# Altium schematic sheet PW.SchDoc
size A4
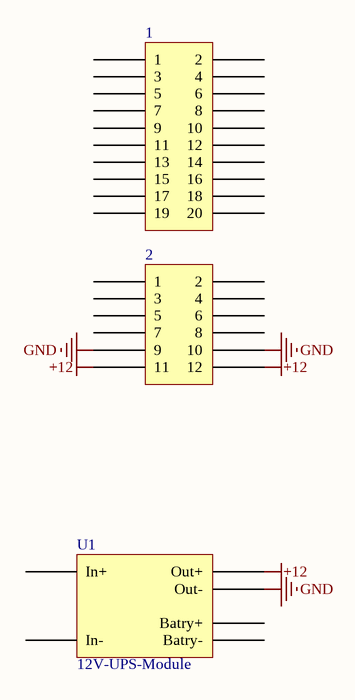
[diagram p0: PW.SchDoc]

## Parts
1  BTB-805-20P  [BoardEdge-3.96-20P]  (value not drawn)
2  BTB-805-12P  [BoardEdge-3.96-12P]  (value not drawn)
U1  12V-UPS-Module  [12V-UPS-Module]

## Nets
+12: 2.11 2.12 U1.3(Out+)
GND: 2.9 2.10 U1.4(Out-)

Not connected (* = marked no-connect by the designer): 1 1 2 3 4 5 6 7 8 9 10 11 12 13 14 15 16 17 18 19 20; 2 1 2 3 4 5 6 7 8; U1 1(In+) 2(In-) 5(Batry+) 6(Batry-)